# EAGLE schematic Schemat (EAGLE 9.6.2)
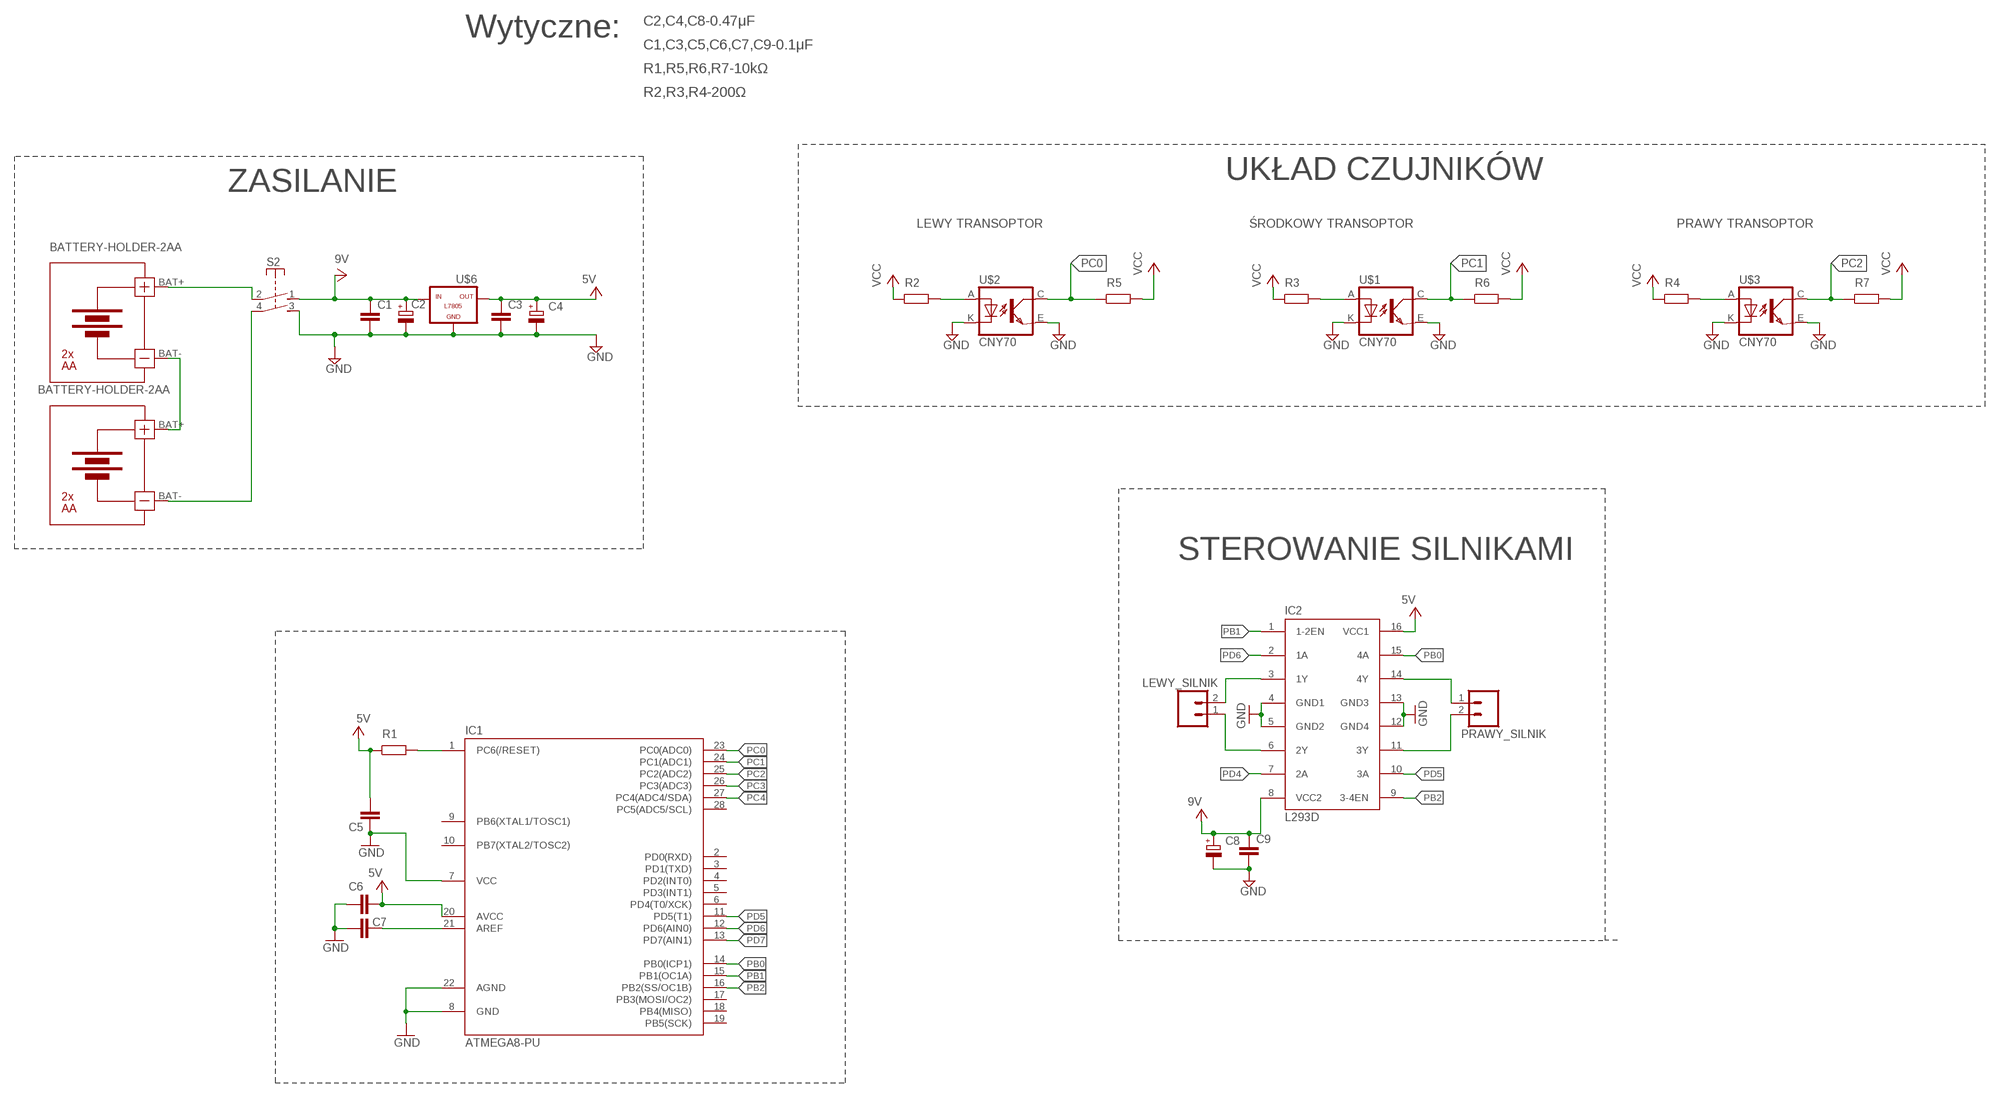
[diagram p0: schematic, sheet 1]

## Parts
C1  C2,5-3  [C2.5-3]
C2  CPOL-EU085CS-1AR  [085CS_1AR]
C3  C2,5-3  [C2.5-3]
C4  0.47μF  CPOL-EU085CS-1AR  [085CS_1AR]
C5  C2,5-3  [C2.5-3]
C6  C2,5-3  [C2.5-3]
C7  C2,5-3  [C2.5-3]
C8  0.47μF  CPOL-EU085CS-1AR  [085CS_1AR]
C9  C2,5-3  [C2.5-3]
IC1  ATMEGA8-PU  [DIL28-3]
IC2  L293D  [DIL16]
LEWY_SILNIK  M02  [02P]
PRAWY_SILNIK  M02  [02P]
R1  R  (no package)
R2  R  (no package)
R3  R  (no package)
R4  R  (no package)
R5  R  (no package)
R6  R  (no package)
R7  R  (no package)
S2  PVA1F  [PVA1F]
U$1  CNY70  [4]
U$2  CNY70  [4]
U$3  CNY70  [4]
U$4  BATTERY-HOLDER-2AA  [BATTERY-HOLDER-2AA]
U$5  BATTERY-HOLDER-2AA  [BATTERY-HOLDER-2AA]
U$6  -L7805  [L7805]

## Nets
GND: C1.2 C2.- C3.2 C4.- C5.1 C6.1 C7.1 C8.- C9.2 IC1.7(VCC) IC1.8(GND) IC1.22(AGND) IC2.4(GND1) IC2.5(GND2) IC2.12(GND4) IC2.13(GND3) S2.3(2:S) U$1.E(EMI) U$1.K(C) U$2.E(EMI) U$2.K(C) U$3.E(EMI) U$3.K(C) U$6.GND
N$1: IC1.1(PC6(/RESET)) R1.2
N$2: U$4.BAT- U$5.BAT+
N$3: S2.2(1:P) U$4.BAT+
N$4: S2.4(2:P) U$5.BAT-
N$5: C7.2 IC1.21(AREF)
N$6: IC2.6(2Y) LEWY_SILNIK.1
N$7: IC2.3(1Y) LEWY_SILNIK.2
N$8: IC2.14(4Y) PRAWY_SILNIK.1
N$9: IC2.11(3Y) PRAWY_SILNIK.2
PB0: IC1.14(PB0(ICP1)) IC2.15(4A)
PB1: IC1.15(PB1(OC1A)) IC2.1(1-2EN)
PB2: IC1.16(PB2(SS/OC1B)) IC2.9(3-4EN)
PC0: IC1.23(PC0(ADC0)) R2.2 R5.1 U$2.A U$2.C(COL)
PC1: IC1.24(PC1(ADC1)) R3.2 R6.1 U$1.A U$1.C(COL)
PC2: IC1.25(PC2(ADC2)) R4.2 R7.1 U$3.A U$3.C(COL)
PC3: IC1.26(PC3(ADC3))
PC4: IC1.27(PC4(ADC4/SDA))
PD4: IC2.7(2A)
PD5: IC1.11(PD5(T1)) IC2.10(3A)
PD6: IC1.12(PD6(AIN0)) IC2.2(1A)
PD7: IC1.13(PD7(AIN1))
VCC: C1.1 C2.+ C3.1 C4.+ C5.2 C6.2 C8.+ C9.1 IC1.20(AVCC) IC2.8(VCC2) IC2.16(VCC1) R1.1 R2.1 R3.1 R4.1 R5.2 R6.2 R7.2 S2.1(1:S) U$6.IN U$6.OUT ; supply symbol labelled 5V, 9V
Unconnected: IC1.2(PD0(RXD)) IC1.3(PD1(TXD)) IC1.4(PD2(INT0)) IC1.5(PD3(INT1)) IC1.6(PD4(T0/XCK)) IC1.9(PB6(XTAL1/TOSC1)) IC1.10(PB7(XTAL2/TOSC2)) IC1.17(PB3(MOSI/OC2)) IC1.18(PB4(MISO)) IC1.19(PB5(SCK)) IC1.28(PC5(ADC5/SCL))

## Notes on the sheet
- C2,C4,C8-0.47μF
- Wytyczne:
- C1,C3,C5,C6,C7,C9-0.1μF
- R1,R5,R6,R7-10kΩ
- R2,R3,R4-200Ω
- UKŁAD CZUJNIKÓW
- ZASILANIE
- LEWY TRANSOPTOR | ŚRODKOWY TRANSOPTOR | PRAWY TRANSOPTOR
- STEROWANIE SILNIKAMI

## Library data of the parts
C1 C3 C5-C7 C9 = capacitor-wima:C: CAPACITOR naming: grid - package width
C2 C4 C8 = rcl:CPOL-EU: POLARIZED CAPACITOR, European symbol; SPICEPREFIX: C
IC1 = atmega8:ATMEGA8-PU
IC2 = st-microelectronics:L293D: PUSH-PULL 4 CHANNEL DRIVER; MPN: L293D; OC_FARNELL: 9589619; OC_NEWARK: 56P8249
LEWY_SILNIK PRAWY_SILNIK = 7805_THT:M02: AMP QUICK CONNECTOR
R1-R7 = ngspice-simulation:R: RESISTOR
S2 = switch-misc:PVA1: ITT SWITCH
U$1-U$3 = cny70:CNY70
U$4 U$5 = diy-modules:BATTERY-HOLDER-2AA: Battery Holder 2 x AA Click here to find device on ebay.com <http://www.ebay.com/sch/battery+plastic+holder+aa+2x1.5v>
U$6 = 7805_THT:-L7805